# EAGLE schematic Power_supply_schematic (EAGLE 6.3)
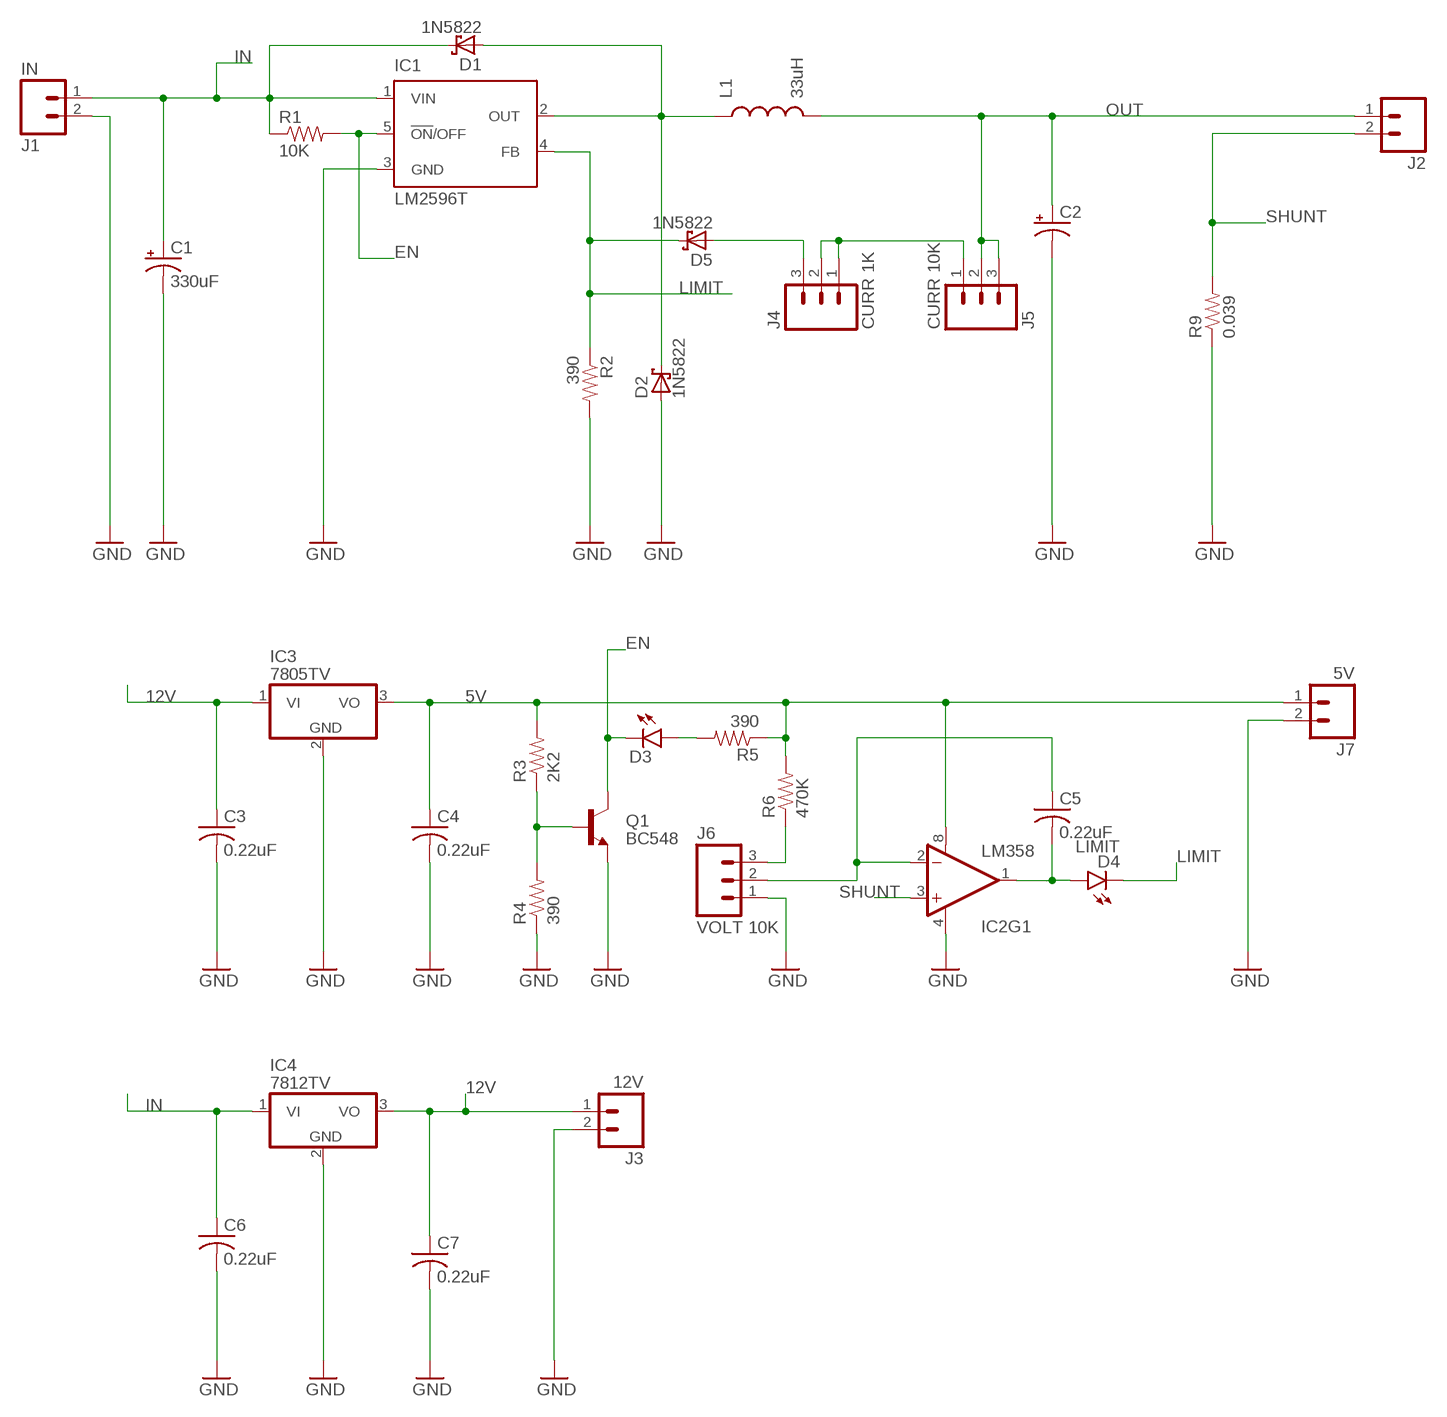
[diagram p0: schematic, sheet 1]

## Parts
C1  330uF  CAP_POLPTH4  [CPOL-RADIAL-1000UF-25V]
C2  CAP_POLPTH4  [CPOL-RADIAL-1000UF-25V]
C3  0.22uF  C-US050-025X075  [C050-025X075]
C4  0.22uF  C-US050-025X075  [C050-025X075]
C5  0.22uF  C-US050-025X075  [C050-025X075]
C6  0.22uF  C-US050-025X075  [C050-025X075]
C7  0.22uF  C-US050-025X075  [C050-025X075]
D1  1N5822  SCHOTTKY-DIODEDO201T15  [DO201T15]
D2  1N5822  SCHOTTKY-DIODEDO201T15  [DO201T15]
D3  LED3MM  [LED3MM]
D4  LIMIT  LED3MM  [LED3MM]
D5  1N5822  SCHOTTKY-DIODEDO201T15  [DO201T15]
IC1  LM2596T  [T05D]
IC2  LM358  [DIP08]
IC3  7805TV  [TO220V]
IC4  7812TV  [TO220V]
J1  IN  M025MM  [SCREWTERMINAL-5MM-2]
J2  M025MM  [SCREWTERMINAL-5MM-2]
J3  12V  M025MM  [SCREWTERMINAL-5MM-2]
J4  CURR 1K  M03POLAR  [MOLEX-1X3]
J5  CURR 10K  M03POLAR  [MOLEX-1X3]
J6  VOLT 10K  M03POLAR  [MOLEX-1X3]
J7  5V  M025MM  [SCREWTERMINAL-5MM-2]
L1  33uH  INDUCTORRLB0912  [RLB0912]
Q1  BC548  TRANSISTOR_NPNBC547  [TO-92-AMMO]
R1  10K  RESISTORPTH-1/4W  [AXIAL-0.4]
R2  390  RESISTORPTH-1/4W  [AXIAL-0.4]
R3  2K2  RESISTORPTH-1/4W  [AXIAL-0.4]
R4  390  RESISTORPTH-1/4W  [AXIAL-0.4]
R5  390  RESISTORPTH-1/4W  [AXIAL-0.4]
R6  470K  RESISTORPTH-1/4W  [AXIAL-0.4]
R9  0.039  RESISTORPTH-1W  [AXIAL-0.6]

## Nets
5V: C4.1 IC2.8(V+) IC3.3(VO) J7.1 R3.P$2 R5.P$1 R6.P$2
12V: C3.1 C7.1 IC3.1(VI) IC4.3(VO) J3.1
EN: D3.K(C) IC1.5(!ON!/OFF) Q1.1(C) R1.P$2
GND: C1.- C2.- C3.2 C4.2 C6.2 C7.2 D2.A IC1.3(GND) IC2.4(V-) IC3.2(GND) IC4.2(GND) J1.2 J3.2 J6.1 J7.2 Q1.3(E) R2.P$2 R4.P$1 R9.P$1
IN: C1.+ C6.1 D1.C IC1.1(VIN) IC4.1(VI) J1.1 R1.P$1
LIMIT: D4.K(C) D5.C IC1.4(FB) R2.P$1
N$1: J4.1 J4.2 J5.1
N$2: D5.A J4.3
N$3: D1.A D2.C IC1.2(OUT) L1.1
N$6: Q1.2(B) R3.P$1 R4.P$2
N$8: C5.2 D4.A IC2.1(OUT)
N$9: D3.A R5.P$2
N$10: J6.3 R6.P$1
N$11: C5.1 IC2.2(-IN) J6.2
OUT: C2.+ J2.1 J5.2 J5.3 L1.2
SHUNT: IC2.3(+IN) J2.2 R9.P$2
Unconnected: IC2.5(+IN) IC2.6(-IN) IC2.7(OUT)

## Library data of the parts
C1 C2 = SparkFun-Capacitors:CAP_POL: Capacitor Polarized These are standard SMD and PTH capacitors. Normally 10uF, 47uF, and 100uF in electrolytic and tantalum varieties. Always verify the external diameter of the through hole cap, it varies with capacity, voltage, and manufacturer. The EIA devices should be standard.
C3-C7 = adafruit:C-US: CAPACITOR, American symbol
D1 D2 D5 = adafruit:SCHOTTKY-DIODE: Schottky Diode
D3 D4 = SparkFun-LED:LED: LEDs Standard schematic elements and footprints for 5mm, 3mm, 1206, and 0603 sized LEDs. 5mm - Spark Fun Electronics SKU : COM-00529 (and others); PROD_ID: DIO-08794
IC1 = national-semiconductor:LM2596: SIMPLE SWITCHER® Power Converter 150 kHz 3A Step-Down Voltage Regulator Source: http://www.national.com/ds/LM/LM2596.pdf; MPN: LM2596T-ADJ/LF02; OC_FARNELL: 9494162; OC_NEWARK: 65K5910
IC2 = SparkFun-AnalogIC:LM358: Jellybean op-amp; PROD_ID: IC-09172
IC3 IC4 = linear:78*: Positive VOLTAGE REGULATOR Source: http://cache.national.com/ds/LM/LM78L05.pdf http://www.fairchildsemi.com/ds/LM/LM7805.pdf
J1-J3 J7 = SparkFun-Connectors:M02: Standard 2-pin 0.1" header. Use with - straight break away headers ( PRT-00116) - right angle break away headers (PRT-00553) - swiss pins (PRT-00743) - machine pins (PRT-00117) - female headers (PRT-00115) Molex polarized connector foot print use with: PRT-08233 with associated crimp pins and housings. 2.54_SCREWTERM for use with PRT-10571. 3.5mm Screw Terminal footprints for PRT-08084 5mm Screw Terminal footprints for use with PRT-08432; STOREFRONT_ID: PRT-08432
J4-J6 = SparkFun-Connectors:M03: Header 3 Standard 3-pin 0.1" header. Use with straight break away headers (SKU : PRT-00116), right angle break away headers (PRT-00553), swiss pins (PRT-00743), machine pins (PRT-00117), and female headers (PRT-00115). Molex polarized connector foot print use with SKU : PRT-08232 with associated crimp pins and housings.
L1 = SparkFun-Passives:INDUCTOR: Inductors Basic Inductor/Choke - 0603 and 1206. Footprints are not proven and vary greatly between part numbers. INDUCTOR POWER 3.3UH 4.0A SMD 0.197" L x 0.197" W x 0.177" H (5.00mm x 5.00mm x 4.50mm)
Q1 = SparkFun-DiscreteSemi:TRANSISTOR_NPN: Generic NPN BJT MMBT2222A - TRANS-08049 (SOT-23, 1A 40V) MPSA42 - TRANS-09116 (SOT-23, 500mA 300V) MMBT5088LT1G - TRANS-11160 (SOT-23, 50 mA 30V) BC547 - COM-08928 <http://www.sparkfun.com/products/8928> (TO-92 45V 100mA) (1.Collector 2.Base 3.Emitter) 2N3904 - COM-00521 <http://www.sparkfun.com/products/521> (TO-92 40V 200mA) (1.Emitter 2.Base 3.Collector) P2N2222A - COM-12852 <http://www.sparkfun.com/products/12852> (TO-92 40V 600mA) (1.Collector 2.Base 3.Emitter)
R1-R6 R9 = SparkFun-Passives:RESISTOR: Resistor Basic schematic elements and footprints for 0603, 1206, and PTH resistors.